# Altium project Semester_Project.PrjPcb
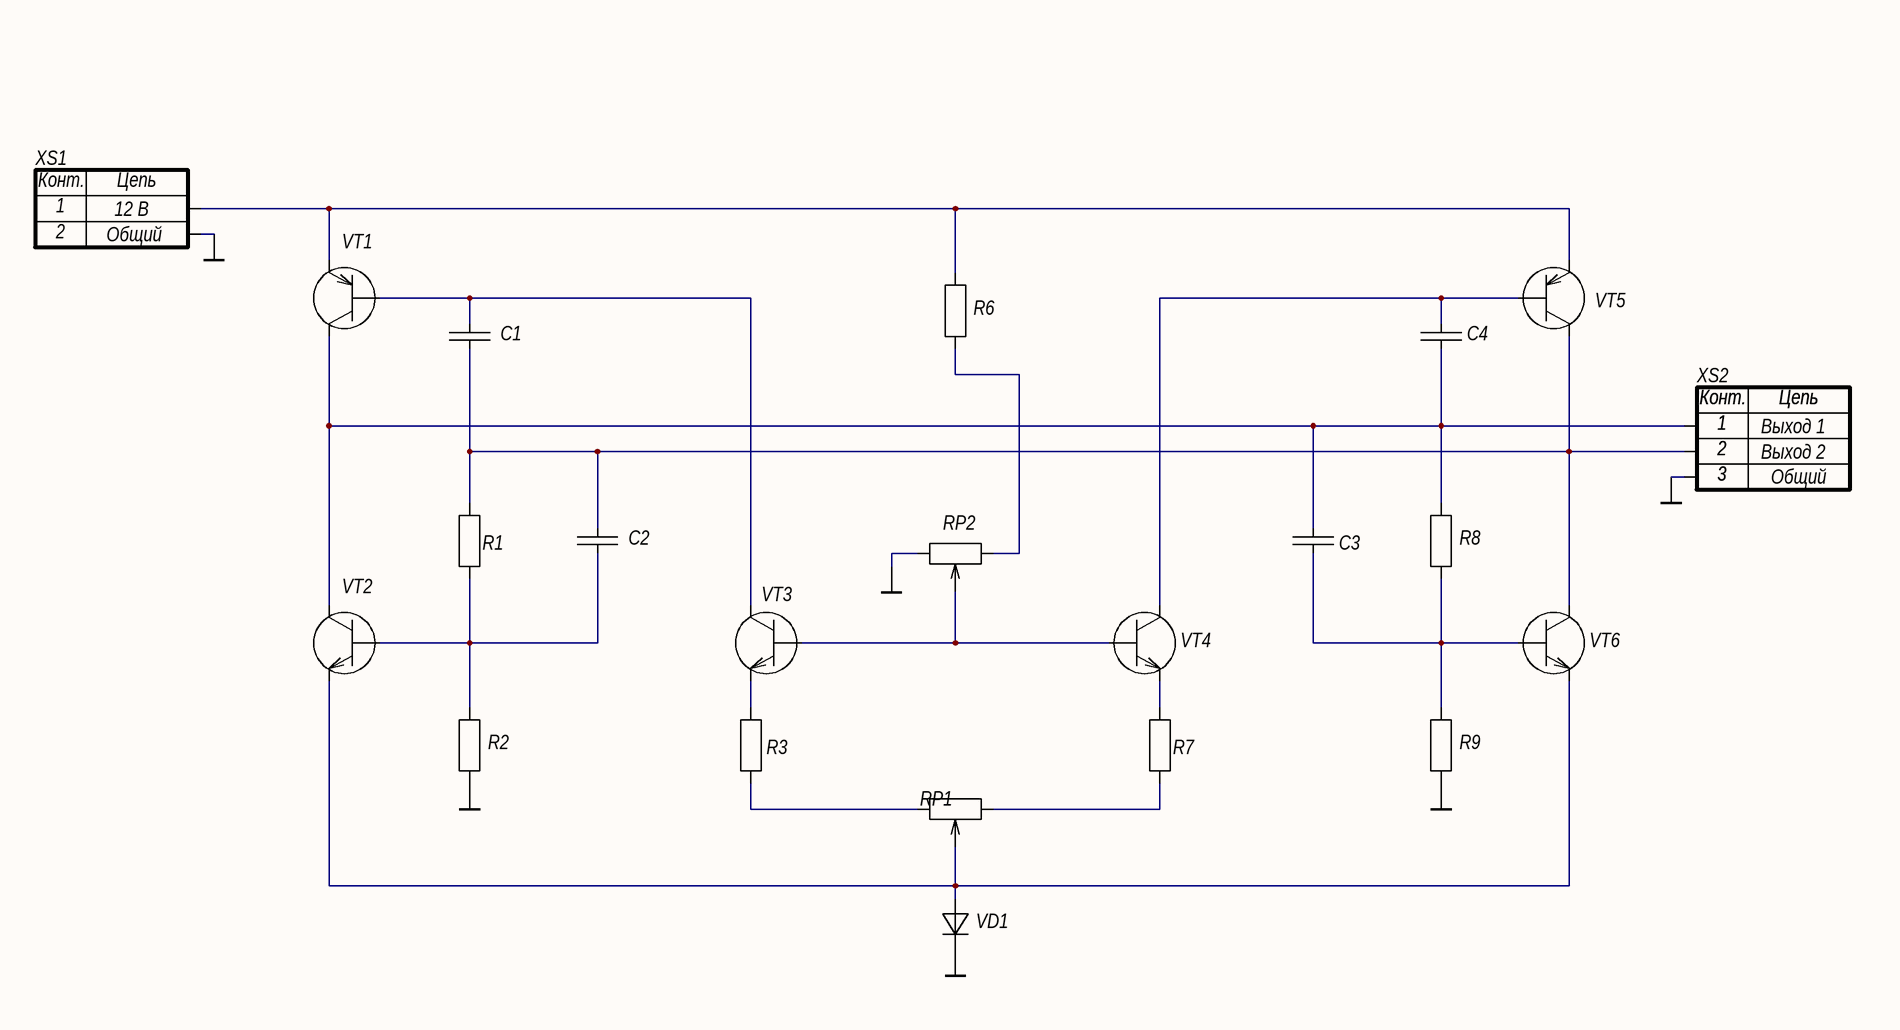
[diagram p0: E3.SchDoc, left]
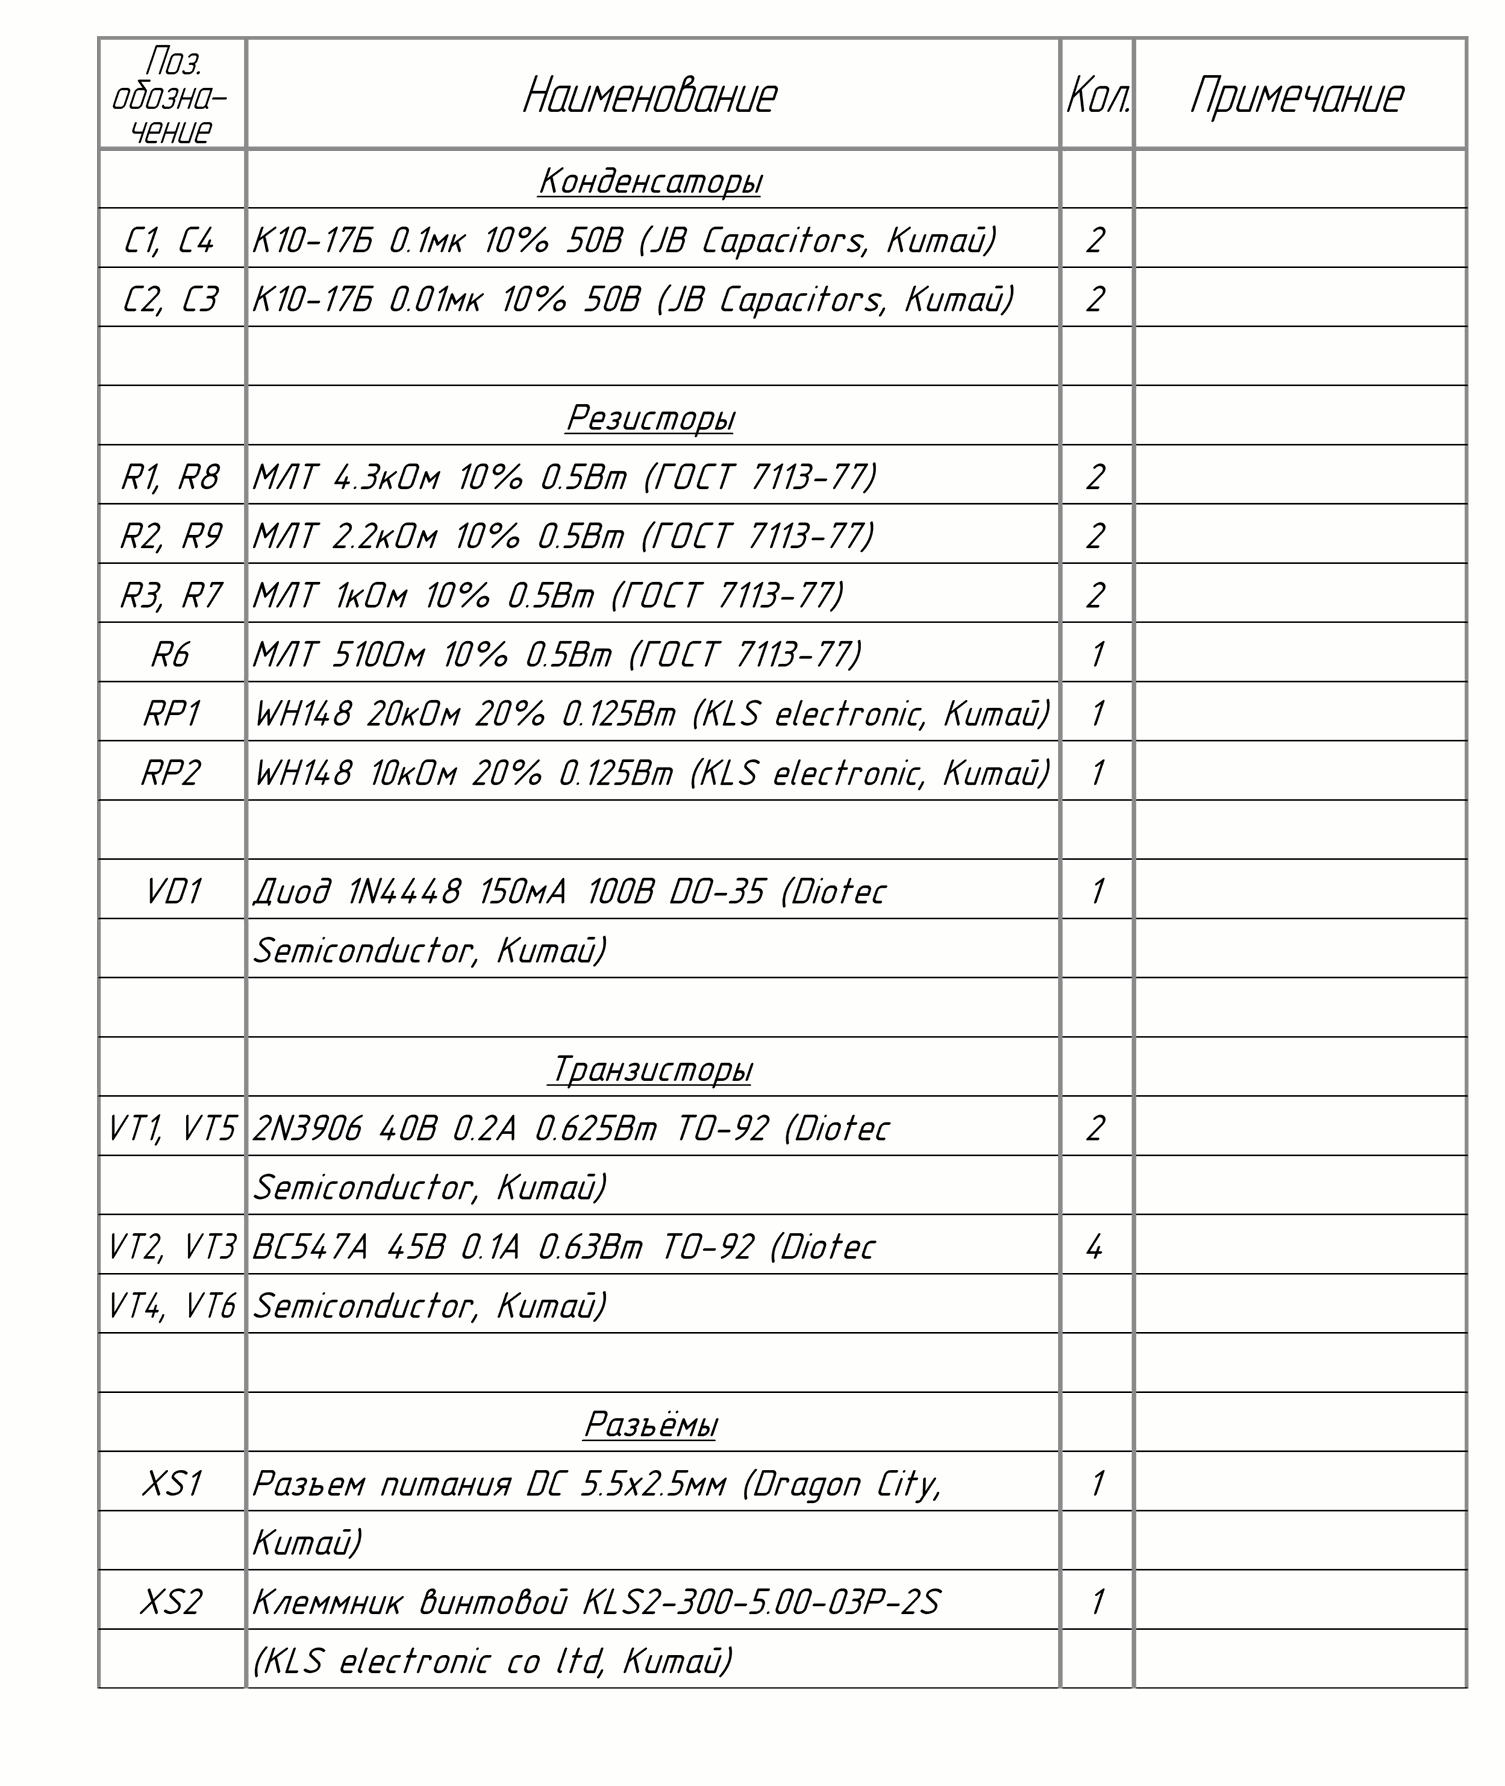
[diagram p1: E3.SchDoc, right]
4 sheets, 22 parts. Net scope: global (net labels, ports and power ports of the same name join across sheets).
Board file: PCB.PcbDoc
Sheets:
  E3.SchDoc
  E1.SchDoc
  Stend.SchDoc
  Stend_old.SchDoc

## Sheet E3.SchDoc: Перестраиваемый генератор
size 840 x 594 mm; CheckedBy: Семенцов С. Г.; Author: Наумов И. К.; Address1: Address1; Address2: Address2; Address3: Address3; Address4: Address4; DocumentNumber: ИУ4.11.03.03.24.05.52.15.001 Э3; SheetNumber: 1; SheetTotal: 4; Title2str: прямоугольных импульсов; DocumentType: Схема электрическая принципиальная; FirstReferrence: ИУ4.11.03.03.24.05.52.15.001

### Parts
C1  0,1мк  [C_THT_5mm]  (value not drawn)
C2  0,01мк  [C_THT_5mm]  (value not drawn)
C3  0,01мк  [C_THT_5mm]  (value not drawn)
C4  0,1мк  [C_THT_5mm]  (value not drawn)
R1  4,3к  [R_THT_10.8mm]  (value not drawn)
R2  2,2к  [R_THT_10.8mm]  (value not drawn)
R3  1к  [R_THT_10.8mm]  (value not drawn)
R6  510  [R_THT_10.8mm]  (value not drawn)
R7  1к  [R_THT_10.8mm]  (value not drawn)
R8  4,3к  [R_THT_10.8mm]  (value not drawn)
R9  2,2к  [R_THT_10.8mm]  (value not drawn)
RP1  20к  [Potentiometer]  (value not drawn)
RP2  10k  [Potentiometer]  (value not drawn)
VD1  VD  [Diode_THT]  (value not drawn)
VT1  2N3906  [TO-92_EBC]  (value not drawn)
VT2  BC547A  [TO-92_CBE]  (value not drawn)
VT3  BC547A  [TO-92_CBE]  (value not drawn)
VT4  BC547A  [TO-92_CBE]  (value not drawn)
VT5  2N3906  [TO-92_EBC]  (value not drawn)
VT6  BC547A  [TO-92_CBE]  (value not drawn)
XS1  XS2_R  [XS2_Power]  (value not drawn)
XS2  XS3_L  [XS3]  (value not drawn)

### Nets
GND: R2.2 R9.2 RP2.1 VD1.2 XS1.2 XS2.3
NetC1_1: C1.1 VT1.2 VT3.1
NetC1_2: C1.2 C2.1 R1.1 VT5.1 VT6.1 XS2.2
NetC2_2: C2.2 R1.2 R2.1 VT2.2
NetC3_1: C3.1 C4.2 R8.1 VT1.1 VT2.1 XS2.1
NetC3_2: C3.2 R8.2 R9.1 VT6.2
NetC4_1: C4.1 VT4.1 VT5.2
NetR3_1: R3.1 VT3.3
NetR3_2: R3.2 RP1.1
NetR6_1: R6.1 RP2.3
NetR6_2: R6.2 VT1.3 VT5.3 XS1.1
NetR7_1: R7.1 VT4.3
NetR7_2: R7.2 RP1.3
NetRP1_2: RP1.2 VD1.1 VT2.3 VT6.3
NetRP2_2: RP2.2 VT3.2 VT4.2

### Notes on the sheet
- (near XS1) 12 В
- (near XS1) Общий
- Выход 1
- Выход 2
- Общий
- Перв. примен.
- Справ. №
- Подп. и дата
- Инв. № дубл.
- Взам. инв. №
- Разраб.
- Изм.
- Лист
- № докум.
- Подп.
- Дата
- Лит.
- Масса
- Масштаб
- Пров.
- Т.контр.
- Листов
- 1
- Инв. № подл.
- Утв.
- Н.контр.
- МГТУ им. Н. Э. Баумана
- Кафедра ИУ4
- Группа ИУ4-52Б
- Копировал
- Формат А1
- (in symbol XS2_R) Конт.; Цепь
- (in symbol XS3_L) Конт.; Цепь

### Library data of the parts
C1-C4 = C
R1-R3 R6-R9 = R
RP1 RP2 = Potentiometer
VT1 VT5 = VT_B_PNP
VT2-VT4 VT6 = VT_B_NPN

## Sheet E1.SchDoc: Перестраиваемый генератор
size 840 x 594 mm; CheckedBy: Семенцов С. Г.; Author: Наумов И. К.; Address1: Address1; Address2: Address2; Address3: Address3; Address4: Address4; DocumentNumber: ИУ4.11.03.03.24.05.52.15.001 Э1; SheetNumber: 2; SheetTotal: 4; Title2str: прямоугольных импульсов; DocumentType: Схема электрическая структурная; FirstReferrence: ИУ4.11.03.03.24.05.52.15.001
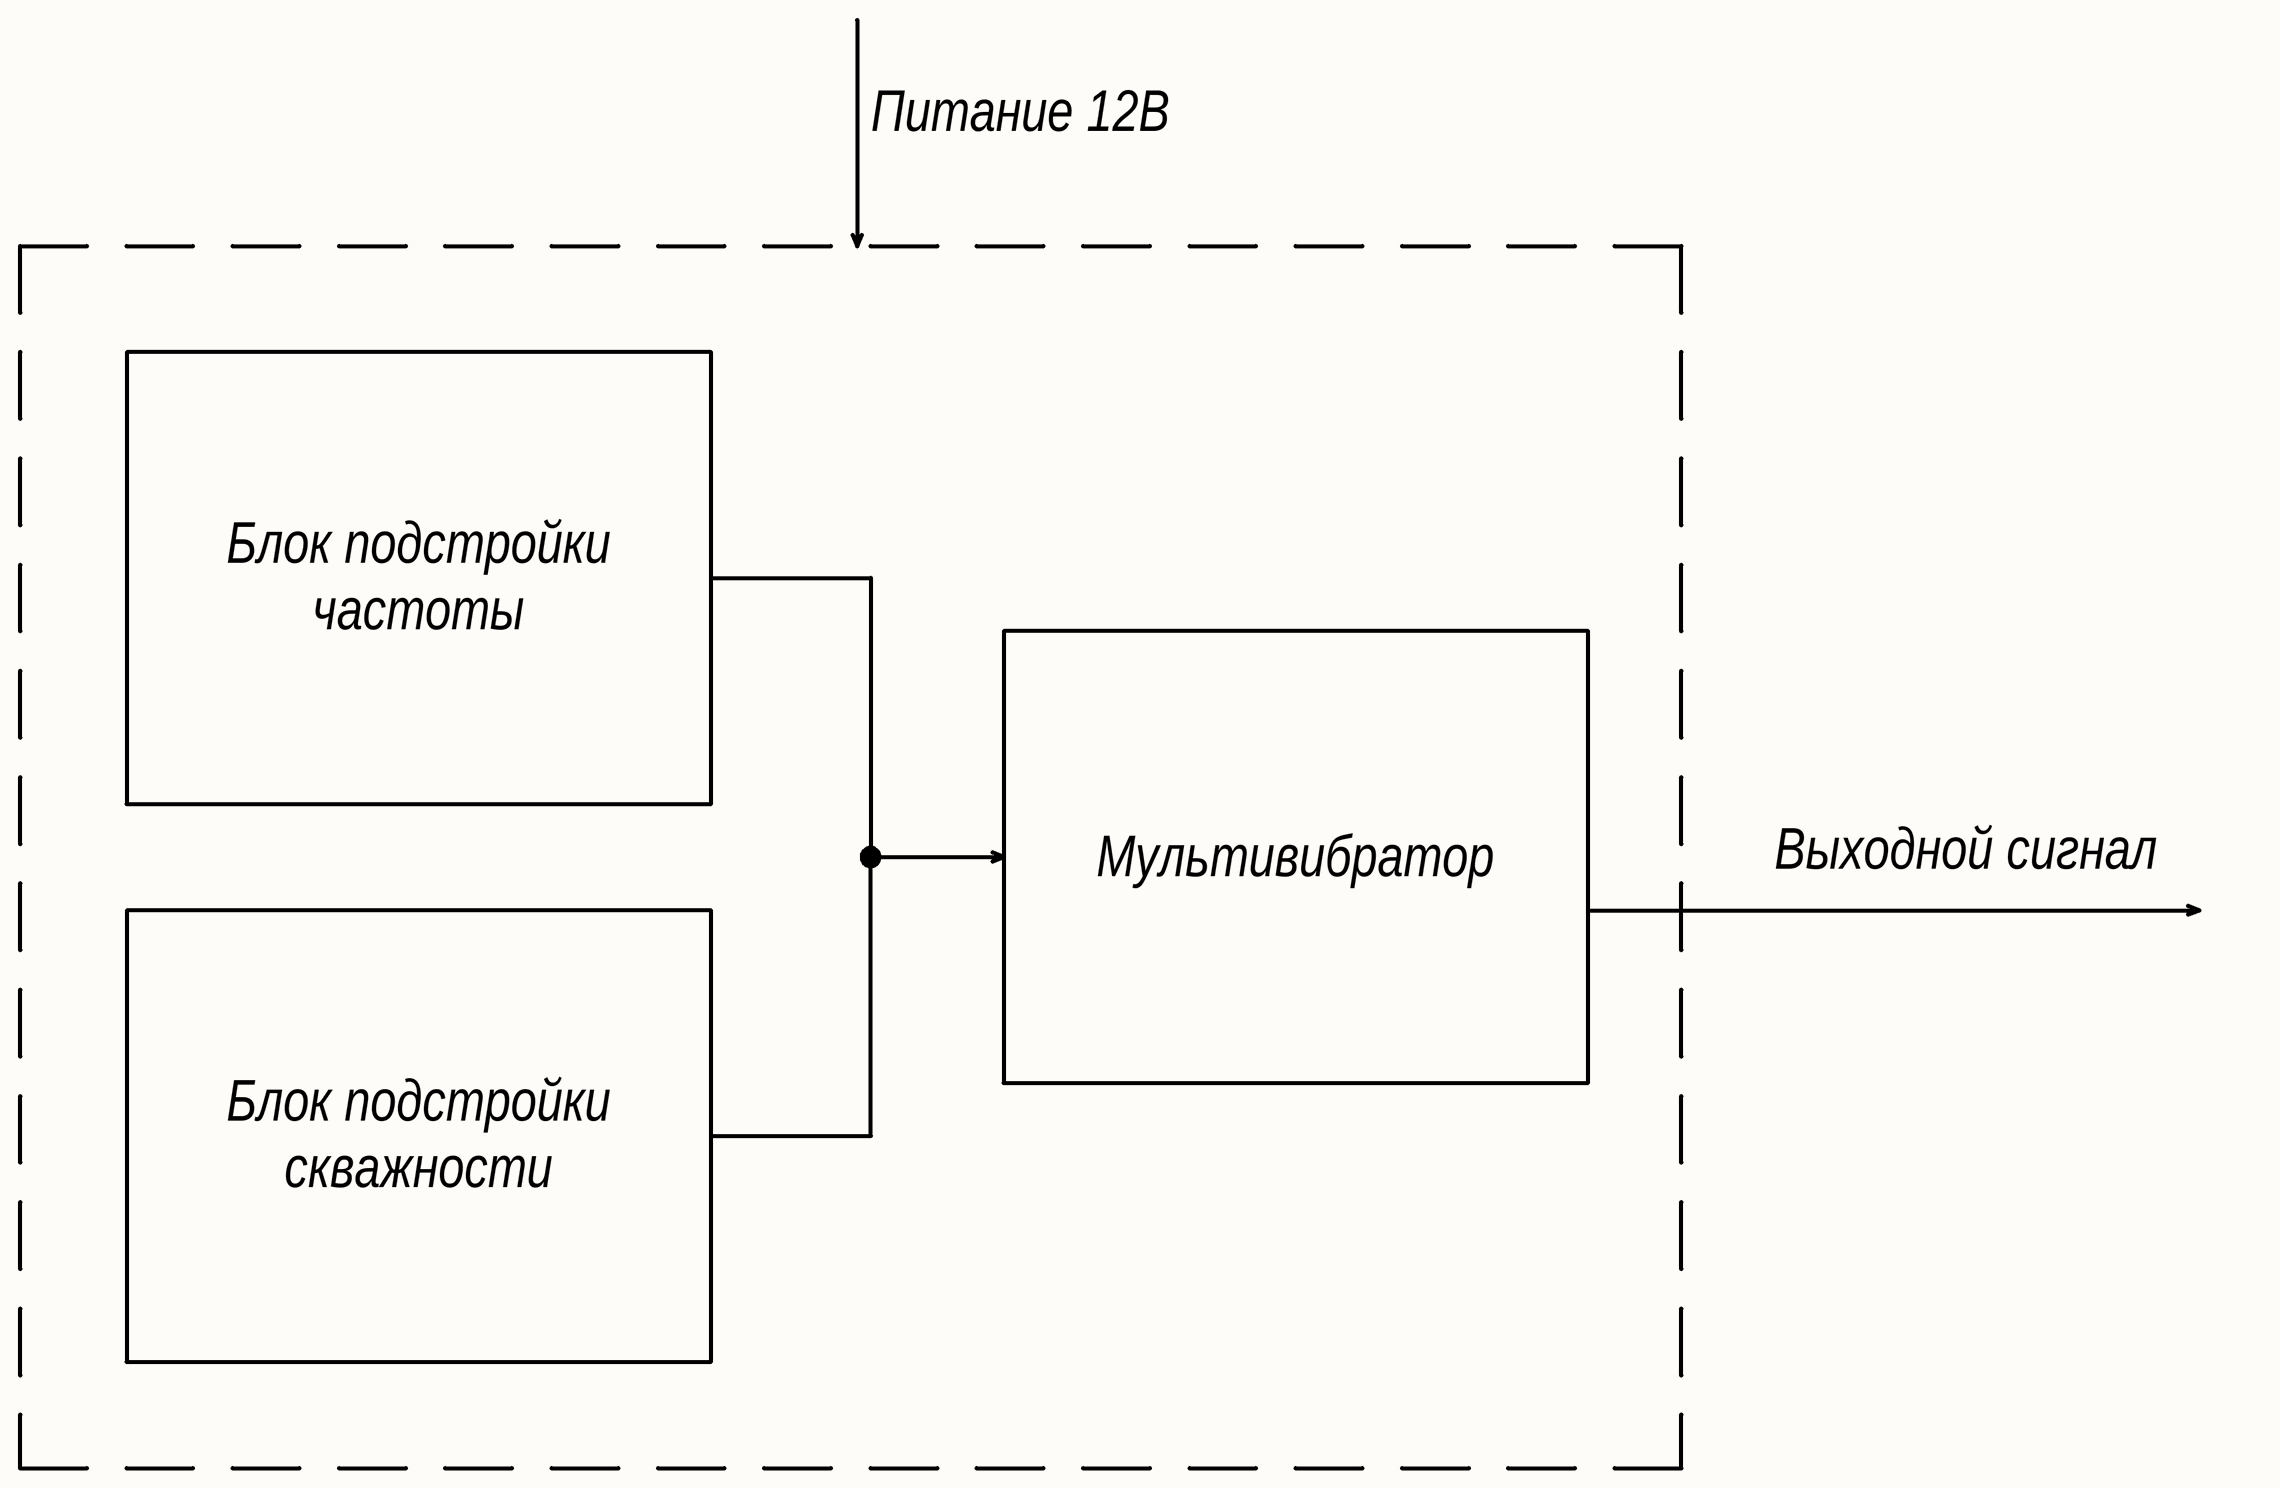
[diagram p2: E1.SchDoc]

### Notes on the sheet
- Питание 12В
- Блок подстройки
- частоты
- Мультивибратор
- Выходной сигнал
- скважности
- Перв. примен.
- Справ. №
- Подп. и дата
- Инв. № дубл.
- Взам. инв. №
- Разраб.
- Изм.
- Лист
- № докум.
- Подп.
- Дата
- Лит.
- Масса
- Масштаб
- Пров.
- Т.контр.
- Листов
- 1
- Инв. № подл.
- Утв.
- Н.контр.
- МГТУ им. Н. Э. Баумана
- Кафедра ИУ4
- Группа ИУ4-52Б
- Копировал
- Формат А1

## Sheet Stend.SchDoc: Перестраиваемый генератор
size 420 x 297 mm; CheckedBy: Семенцов С. Г.; Author: Наумов И. К.; Address1: Address1; Address2: Address2; Address3: Address3; Address4: Address4; DocumentNumber: ИУ4.11.03.03.24.05.52.15.003 Э1; SheetNumber: 3; SheetTotal: 4; Title2str: прямоугольных импульсов; DocumentType: Структурная схема измерительного стенда; FirstReferrence: ИУ4.11.03.03.24.05.52.15.001
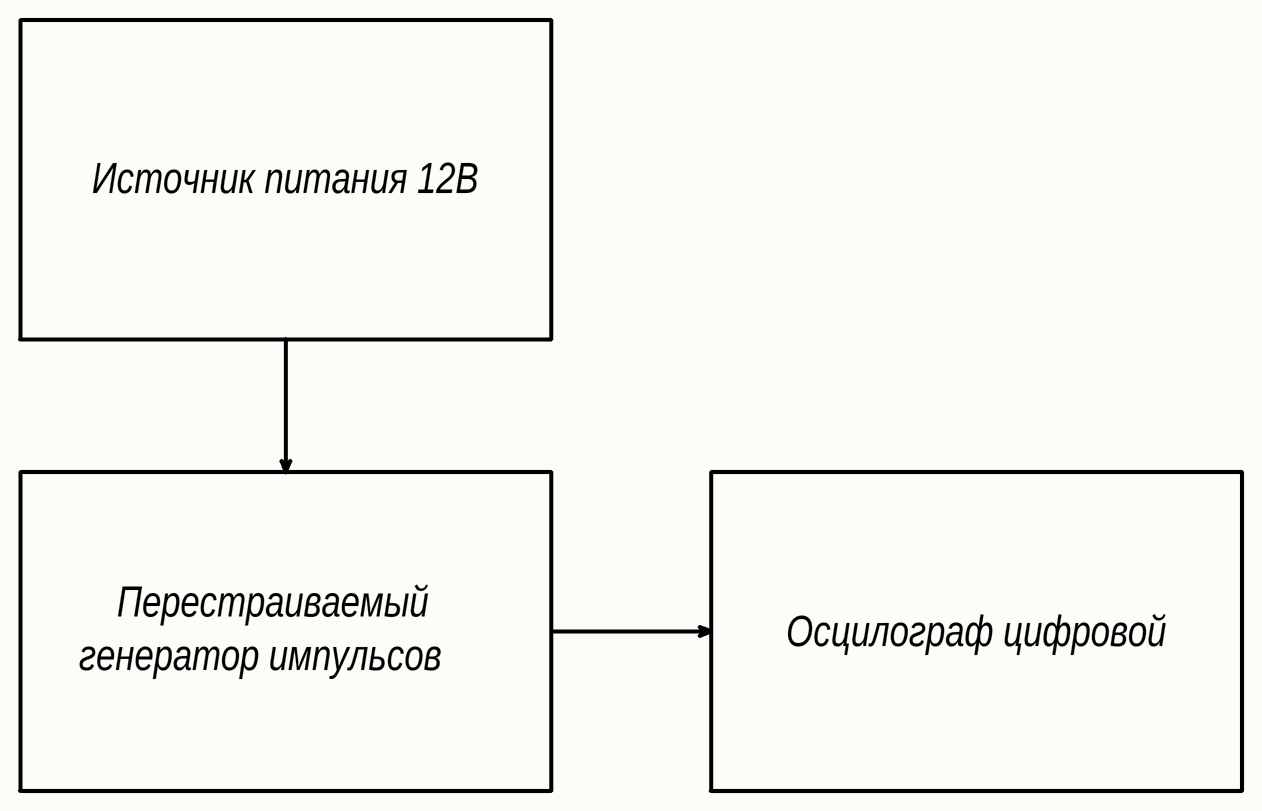
[diagram p3: Stend.SchDoc]

### Notes on the sheet
- Источник питания 12В
- Перестраиваемый
- Осцилограф цифровой
- генератор импульсов
- Перв. примен.
- Справ. №
- Подп. и дата
- Инв. № дубл.
- Взам. инв. №
- Разраб.
- Изм.
- Лист
- № докум.
- Подп.
- Дата
- Лит.
- Масса
- Масштаб
- Пров.
- Т.контр.
- Листов
- 1
- Инв. № подл.
- Утв.
- Н.контр.
- Кафедра ИУ4
- МГТУ им. Н. Э. Баумана
- 2.106-A3
- Копировал
- Формат А3
- Группа ИУ4-52Б

## Sheet Stend_old.SchDoc: Перестраиваемый генератор
size 840 x 594 mm; CheckedBy: Семенцов С. Г.; Author: Наумов И. К.; Address1: Address1; Address2: Address2; Address3: Address3; Address4: Address4; DocumentNumber: ИУ4.11.03.03.24.05.52.15.001 Э1; SheetNumber: 4; SheetTotal: 6; Title2str: прямоугольных импульсов; DocumentType: Схема измерительного стенда; FirstReferrence: ИУ4.11.03.03.24.05.52.15.001
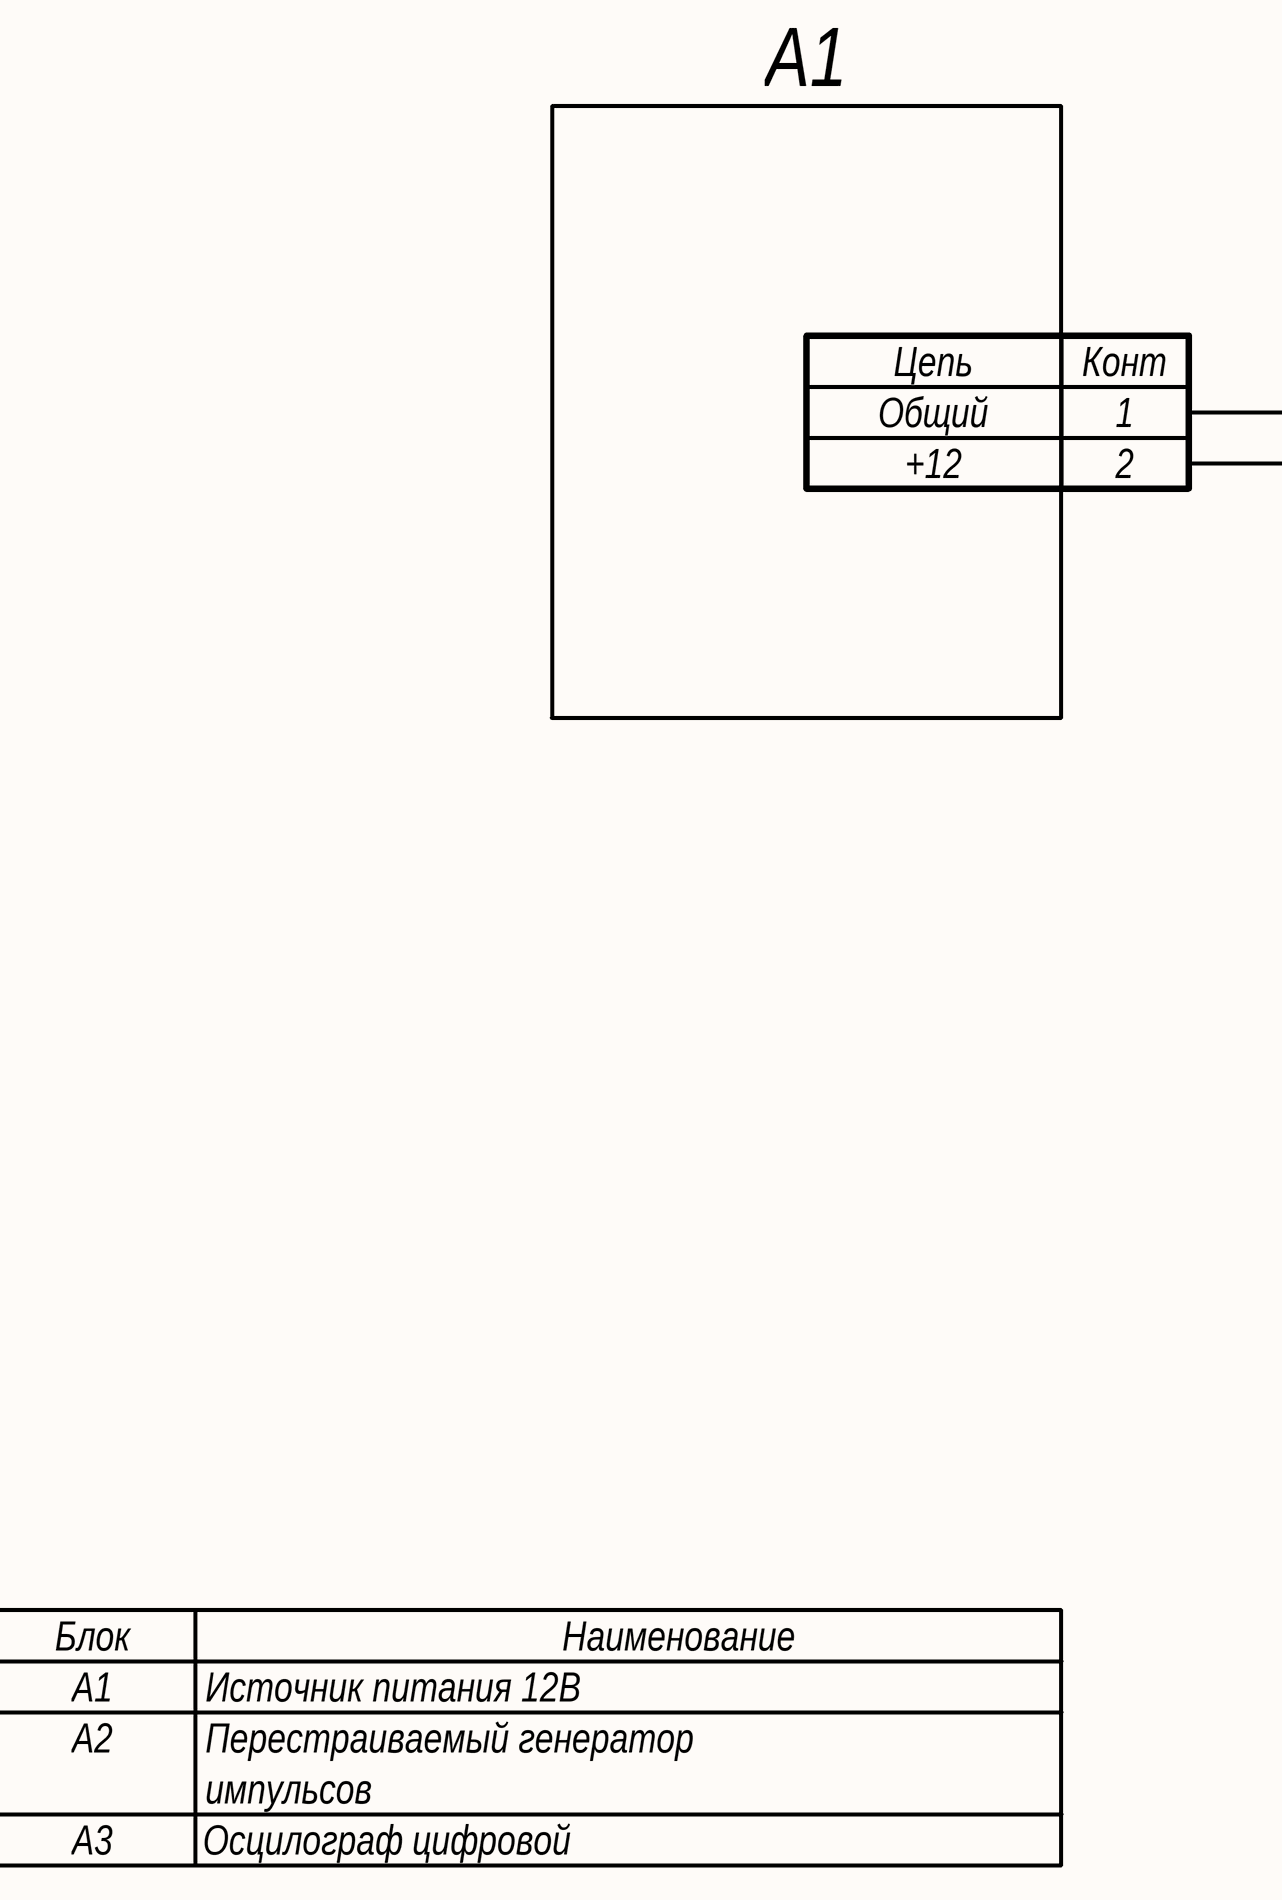
[diagram p4: Stend_old.SchDoc, left]
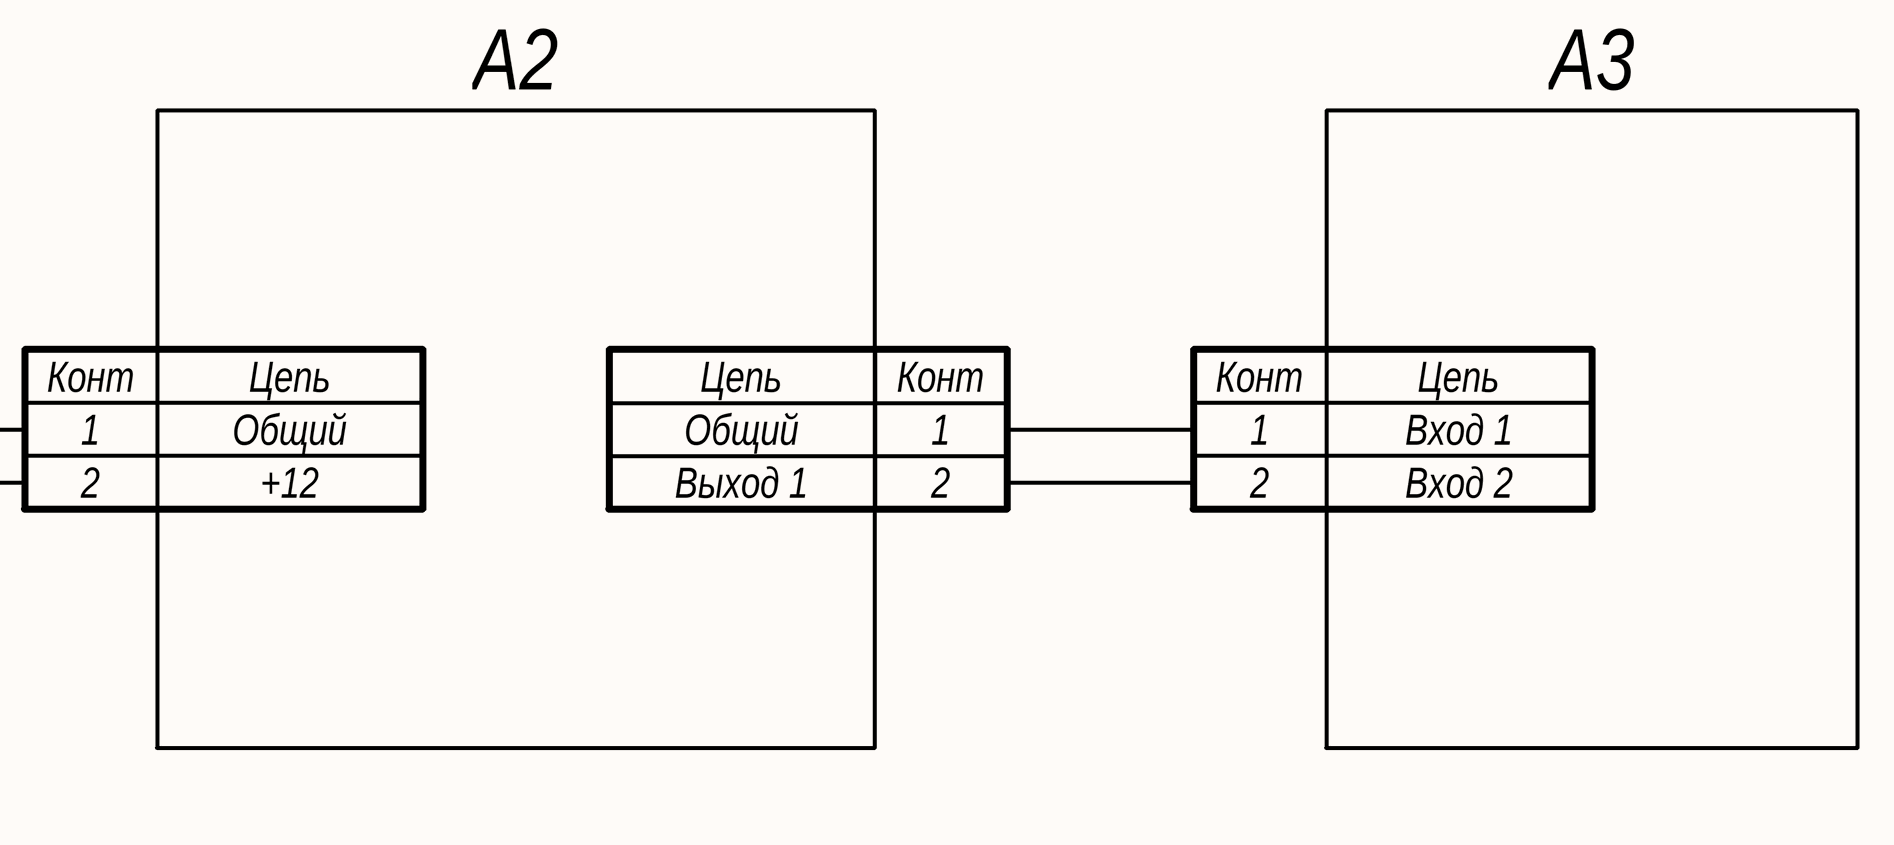
[diagram p5: Stend_old.SchDoc, right]

### Notes on the sheet
- A1
- A2
- A3
- Цепь
- Конт
- Общий
- 1
- Вход 1
- +12
- 2
- Выход 1
- Вход 2
- Блок
- Наименование
- А1
- А2
- Перестраиваемый генератор
- Источник питания 12В
- импульсов
- А3
- Осцилограф цифровой
- Перв. примен.
- Справ. №
- Подп. и дата
- Инв. № дубл.
- Взам. инв. №
- Разраб.
- Изм.
- Лист
- № докум.
- Подп.
- Дата
- Лит.
- Масса
- Масштаб
- Пров.
- Т.контр.
- Листов
- Инв. № подл.
- Утв.
- Н.контр.
- МГТУ им. Н. Э. Баумана
- Кафедра ИУ4
- Группа ИУ4-52Б
- Копировал
- Формат А1